# Altium project roneMotorBoard-v14.PrjPcb
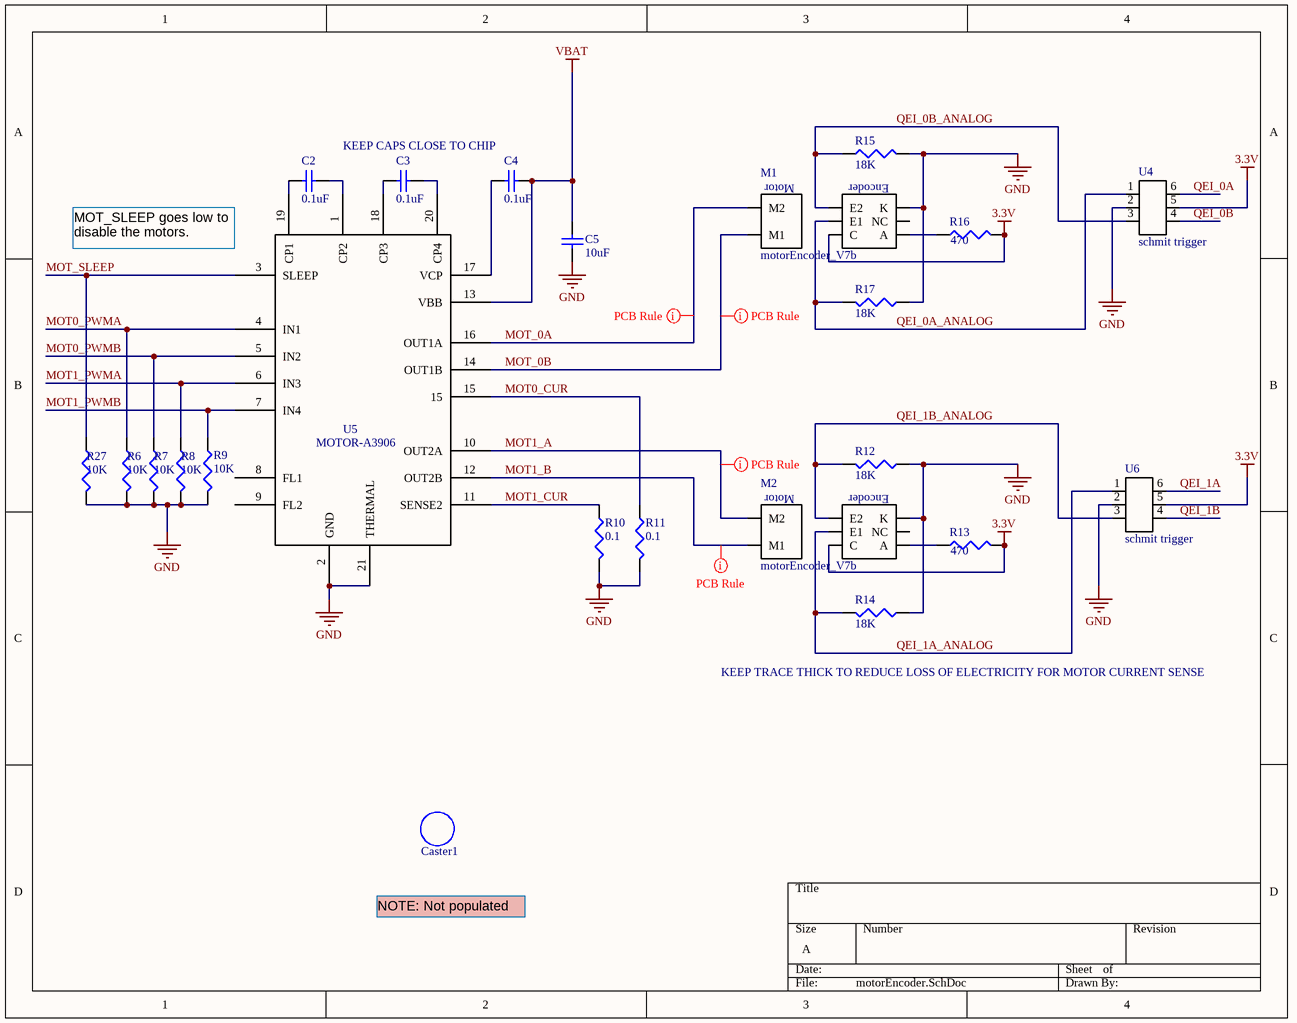
[diagram p0: motorEncoder.SchDoc]
3 sheets, 79 parts. Net scope: global (net labels, ports and power ports of the same name join across sheets).
Board file: roneMotorBoard-v14.PcbDoc
Sheets:
  motorEncoder.SchDoc
  Power.SchDoc
  BumpSensors.SchDoc

## Sheet motorEncoder.SchDoc: r-one Motor
size A; Date: 08/09/2011; DrawnBy: MRSL; Engineer: MRSL; Organization: Rice University; Revision: V11; SheetNumber: roneV11-motorEncoder; SheetTotal: 6; DocumentName: RoneV11-motorEncoder

### Parts
C2  value 0.1uF  [CAPC1005L]  (hidden comment: Cap Semi)
C3  value 0.1uF  [CAPC1005L]  (hidden comment: Cap Semi)
C4  value 0.1uF  [CAPC1005L]  (hidden comment: Cap Semi)
C5  value 10uF  [CAPC1608L]  (hidden comment: Cap Semi)
Caster1  non connect  [3/4"CASTER2]  (value not drawn)
M1  motorEncoder_V7b  [motorEncoder_V7b]
M2  motorEncoder_V7b  [motorEncoder_V7b]
R6  value 10K  [RESC1608L]  (hidden comment: Res3)
R7  value 10K  [RESC1608L]  (hidden comment: Res3)
R8  value 10K  [RESC1608L]  (hidden comment: Res3)
R9  value 10K  [RESC1608L]  (hidden comment: Res3)
R10  value 0.1  [RESC1608L]  (hidden comment: Res3)
R11  value 0.1  [RESC1608L]  (hidden comment: Res3)
R12  value 18K  [RESC1608L]
R13  value 470  [RESC1608L]
R14  value 18K  [RESC1608L]
R15  value 18K  [RESC1608L]
R16  value 470  [RESC1608L]
R17  value 18K  [RESC1608L]
R27  value 10K  [CAPC1608L]  (hidden comment: Res3)
U4  schmit trigger  [DCK(R-PDSO-C6)]
U5  MOTOR-A3906  [QFN-20]
U6  schmit trigger  [DCK(R-PDSO-C6)]

### Nets
3.3V: M1.C M2.C R13.2 R16.2 U4.5 U6.5
GND: C5.1 M1.K M2.K R6.2 R7.2 R8.2 R9.2 R10.2 R11.2 R12.1 R14.1 R15.2 R17.1 R27.2 U4.2 U5.2(GND) U5.21(THERMAL) U6.2
VBAT: C4.1 C5.2 U5.13(VBB)
MOT0_CUR: R11.1 U5.15
MOT0_PWMA: R6.1 U5.4(IN1)
MOT0_PWMB: R7.1 U5.5(IN2)
MOT1_A: M2.M2 U5.10(OUT2A)
MOT1_B: M2.M1 U5.12(OUT2B)
MOT1_CUR: R10.1 U5.11(SENSE2)
MOT1_PWMA: R8.1 U5.6(IN3)
MOT1_PWMB: R9.1 U5.7(IN4)
MOT_0A: M1.M2 U5.16(OUT1A)
MOT_0B: M1.M1 U5.14(OUT1B)
MOT_SLEEP: R27.1 U5.3(SLEEP)
QEI_0A: U4.6
QEI_0A_ANALOG: M1.E1 R17.2 U4.1
QEI_0B: U4.4
QEI_0B_ANALOG: M1.E2 R15.1 U4.3
QEI_1A: U6.6
QEI_1A_ANALOG: M2.E1 R14.2 U6.1
QEI_1B: U6.4
QEI_1B_ANALOG: M2.E2 R12.2 U6.3
NetC2_1: C2.1 U5.19(CP1)
NetC2_2: C2.2 U5.1(CP2)
NetC3_1: C3.1 U5.18(CP3)
NetC3_2: C3.2 U5.20(CP4)
NetC4_2: C4.2 U5.17(VCP)
NetM1_A: M1.A R16.1
NetM2_A: M2.A R13.1

Not connected (* = marked no-connect by the designer): M1 NC; M2 NC; U5 8(FL1) 9(FL2)

### Layout directives
rule Width Constraint [Pref Width = 20mil    Min Width = 10mil    Max Width = 25mil]: MOT1_A, MOT1_B, MOT_0A, MOT_0B

### Notes on the sheet
- KEEP CAPS CLOSE TO CHIP
- (near U5) MOT_SLEEP goes low to disable the motors.
- KEEP TRACE THICK TO REDUCE LOSS OF ELECTRICITY FOR MOTOR CURRENT SENSE
- NOTE: Not populated
- (in symbol motorEncoder_V7b) Motor; Encoder

### Library data of the parts
C2-C5 = Cap Semi: Capacitor (Semiconductor SIM Model); Published: 8-Jun-2000; LatestRevisionDate: 29-May-2009; LatestRevisionNote: IPC-7351 Footprint Added.; PackageReference: C1206; Publisher: Altium Limited; PackageDescription: Chip Capacitor
Caster1 = Caster 3/4in: This is just a space saver to get the caster onto the pcb
R6-R17 R27 = Res3: Resistor; Published: 8-Jun-2000; LatestRevisionDate: 29-May-2009; LatestRevisionNote: IPC-7351 Footprint Added.; PackageReference: J1-0603; Publisher: Altium Limited; PackageDescription: Chip Resistor

## Sheet Power.SchDoc
size A; SheetNumber: roneV11-Power; SheetTotal: 6
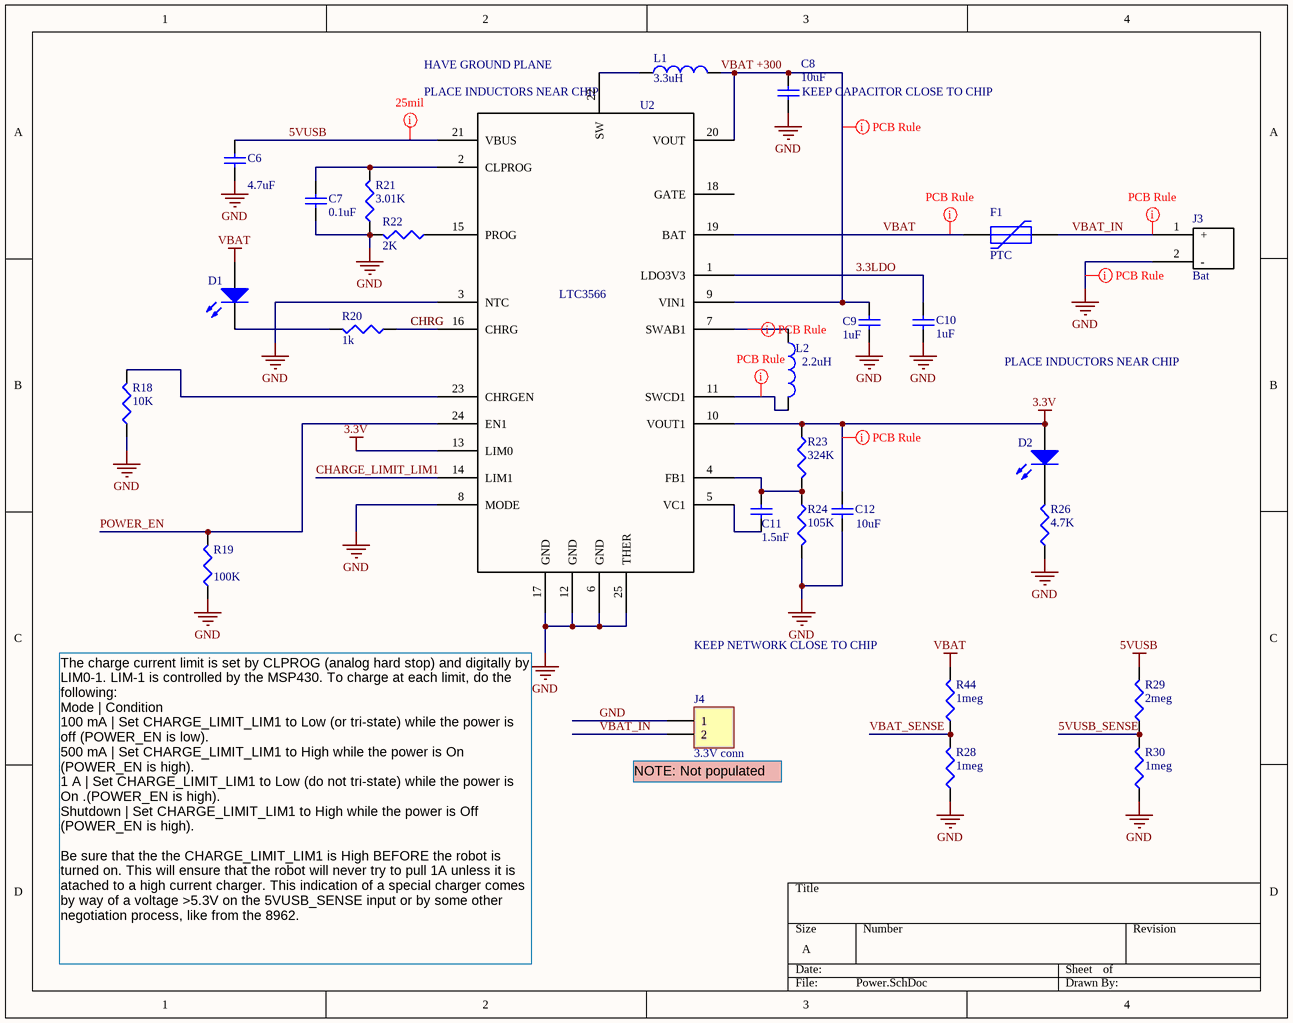
[diagram p1: Power.SchDoc]

### Parts
C6  value 4.7uF  [CAPC1608L]  (hidden comment: Cap Semi)
C7  value 0.1uF  [CAPC1005L]  (hidden comment: Cap)
C8  value 10uF  [CAPC1608L]  (hidden comment: Cap)
C9  value 1uF  [CAPC1608L]  (hidden comment: Cap)
C10  value 1uF  [CAPC1608L]  (hidden comment: Cap)
C11  value 1.5nF  [CAPC1005L]  (hidden comment: Cap)
C12  value 10uF  [CAPC1608L]  (hidden comment: Cap)
D1  Charge  [INDC2012L]  (value not drawn)
D2  Power  [INDC2012L]  (value not drawn)
F1  PTC  [ERJ8G-1206]
J3  Bat  [BatteryConnJST]
J4  3.3V conn  [HDR1X2]
L1  3.3uH  [IndPow]
L2  2.2uH  [IndPow]
R18  value 10K  [RESC1608L]  (hidden comment: Res3)
R19  value 100K  [RESC1608L]  (hidden comment: Res3)
R20  value 1k  [RESC1608L]  (hidden comment: Res3)
R21  value 3.01K  [RESC1608L]  (hidden comment: Res3)
R22  value 2K  [RESC1608L]  (hidden comment: Res3)
R23  value 324K  [RESC1608L]  (hidden comment: Res3)
R24  value 105K  [RESC1608L]  (hidden comment: Res3)
R26  value 4.7K  [RESC1608L]  (hidden comment: Res3)
R28  value 1meg  [RESC1608L]  (hidden comment: Res3)
R29  value 2meg  [RESC1608L]  (hidden comment: Res3)
R30  value 1meg  [RESC1608L]  (hidden comment: Res3)
R44  value 1meg  [RESC1608L]  (hidden comment: Res3)
U2  LTC3566  [QFN-24]

### Nets
3.3LDO: C10.1 U2.1(LDO3V3)
3.3V: C12.2 D2.1(A) R23.1 U2.10(VOUT1) U2.13(LIM0)
5VUSB: C6.2 R29.2 U2.21(VBUS)
GND: C6.1 C7.1 C8.1 C9.2 C10.2 C12.1 J3.2(-) J4.1 R18.1 R19.1 R21.1 R22.2 R24.2 R26.1 R28.1 R30.1 U2.3(NTC) U2.6(GND) U2.8(MODE) U2.12(GND) U2.17(GND) U2.25(THER)
VBAT: D1.1(A) F1.1 R44.2 U2.19(BAT)
5VUSB_SENSE: R29.1 R30.2
CHARGE_LIMIT_LIM1: U2.14(LIM1)
CHRG: R20.1 U2.16(CHRG)
POWER_EN: R19.2 U2.24(EN1)
VBAT +300: C8.2 C9.1 L1.2 U2.9(VIN1) U2.20(VOUT)
VBAT_IN: F1.2 J3.1(+) J4.2
VBAT_SENSE: R28.2 R44.1
NetC7_2: C7.2 R21.2 U2.2(CLPROG)
NetC11_1: C11.1 R23.2 R24.1 U2.4(FB1)
NetC11_2: C11.2 U2.5(VC1)
NetD1_2: D1.2(K) R20.2
NetD2_2: D2.2(K) R26.2
NetL1_1: L1.1 U2.22(SW)
NetL2_1: L2.1 U2.7(SWAB1)
NetL2_2: L2.2 U2.11(SWCD1)
NetR18_2: R18.2 U2.23(CHRGEN)
NetR22_1: R22.1 U2.15(PROG)

Not connected (* = marked no-connect by the designer): U2 18(GATE)

### Layout directives
rule Width Constraint [Pref Width = 25mil    Min Width = 10mil    Max Width = 25mil]: 5VUSB, GND, NetL2_1, NetL2_2, VBAT +300, VBAT_IN
rule Width Constraint [Pref Width = 25mil    Min Width = 10mil    Max Width = 100mil]: 3.3V
rule Width Constraint [Pref Width = 25mil    Min Width = 10mil    Max Width = 50mil]: VBAT

### Notes on the sheet
- (near U2) HAVE GROUND PLANE
- (near U2) PLACE INDUCTORS NEAR CHIP
- (near C8) KEEP CAPACITOR CLOSE TO CHIP
- CHRG
- PLACE INDUCTORS NEAR CHIP
- KEEP NETWORK CLOSE TO CHIP
- (near J4) NOTE: Not populated
- The charge current limit is set by CLPROG (analog hard stop) and digitally by LIM0-1. LIM-1 is controlled by the MSP430. To charge at each limit, do the following:
  Mode	| Condition
  100 mA	| Set CHARGE_LIMIT_LIM1 to Low (or tri-state) while the power is off (POWER_EN is low).
  500 mA	| Set CHARGE_LIMIT_LIM1 to High while the power is On (POWER_EN is high).
  1 A	| Set CHARGE_LIMIT_LIM1 to Low (do not tri-state) while the power is On .(POWER_EN is high).
  Shutdown | Set CHARGE_LIMIT_LIM1 to High while the power is Off (POWER_EN is high).
  Be sure that the the CHARGE_LIMIT_LIM1 is High BEFORE the robot is turned on. This will ensure that the robot will never try to pull 1A unless it is atached to a high current charger. This indication of a special charger comes by way of a voltage >5.3V on the 5VUSB_SENSE input or by some other negotiation process, like from the 8962.

### Library data of the parts
C6 = Cap Semi: Capacitor (Semiconductor SIM Model); Published: 8-Jun-2000; LatestRevisionDate: 29-May-2009; LatestRevisionNote: IPC-7351 Footprint Added.; PackageReference: C1206; Publisher: Altium Limited; PackageDescription: Chip Capacitor
C7-C12 = Cap: Capacitor; Published: 8-Jun-2000; LatestRevisionDate: 17-Jul-2002; LatestRevisionNote: Re-released for DXP Platform.; PackageReference: RAD-0.3; Publisher: Altium Limited
D1 D2 = LED2: Typical RED, GREEN, YELLOW, AMBER GaAs LED; Published: 8-Jun-2000; LatestRevisionDate: 17-Jul-2002; LatestRevisionNote: Re-released for DXP Platform.; PackageVersion: Feb-2002; PackageReference: 3.2X1.6X1.1; Publisher: Altium Limited
F1 = PTC_FUSE: Fuse; Published: 8-Jun-2000; LatestRevisionDate: 17-Jul-2002; LatestRevisionNote: Re-released for DXP Platform.; PackageReference: PIN-W2/E2.8; Publisher: Altium Limited
J3 = BatteryConnJST
J4 = Header 2: Header, 2-Pin; LatestRevisionDate: 17-Jul-2002; LatestRevisionNote: Re-released for DXP Platform.; Publisher: Altium Limited
L1 L2 = Inductor
  L1: Value: 3.3uH
  L2: Value: 2.2uH
R18-R24 R26 R28-R30 R44 = Res3: Resistor; Published: 8-Jun-2000; LatestRevisionDate: 29-May-2009; LatestRevisionNote: IPC-7351 Footprint Added.; PackageReference: J1-0603; Publisher: Altium Limited; PackageDescription: Chip Resistor

## Sheet BumpSensors.SchDoc
size A; SheetNumber: roneV11-BumpSensors; SheetTotal: 6
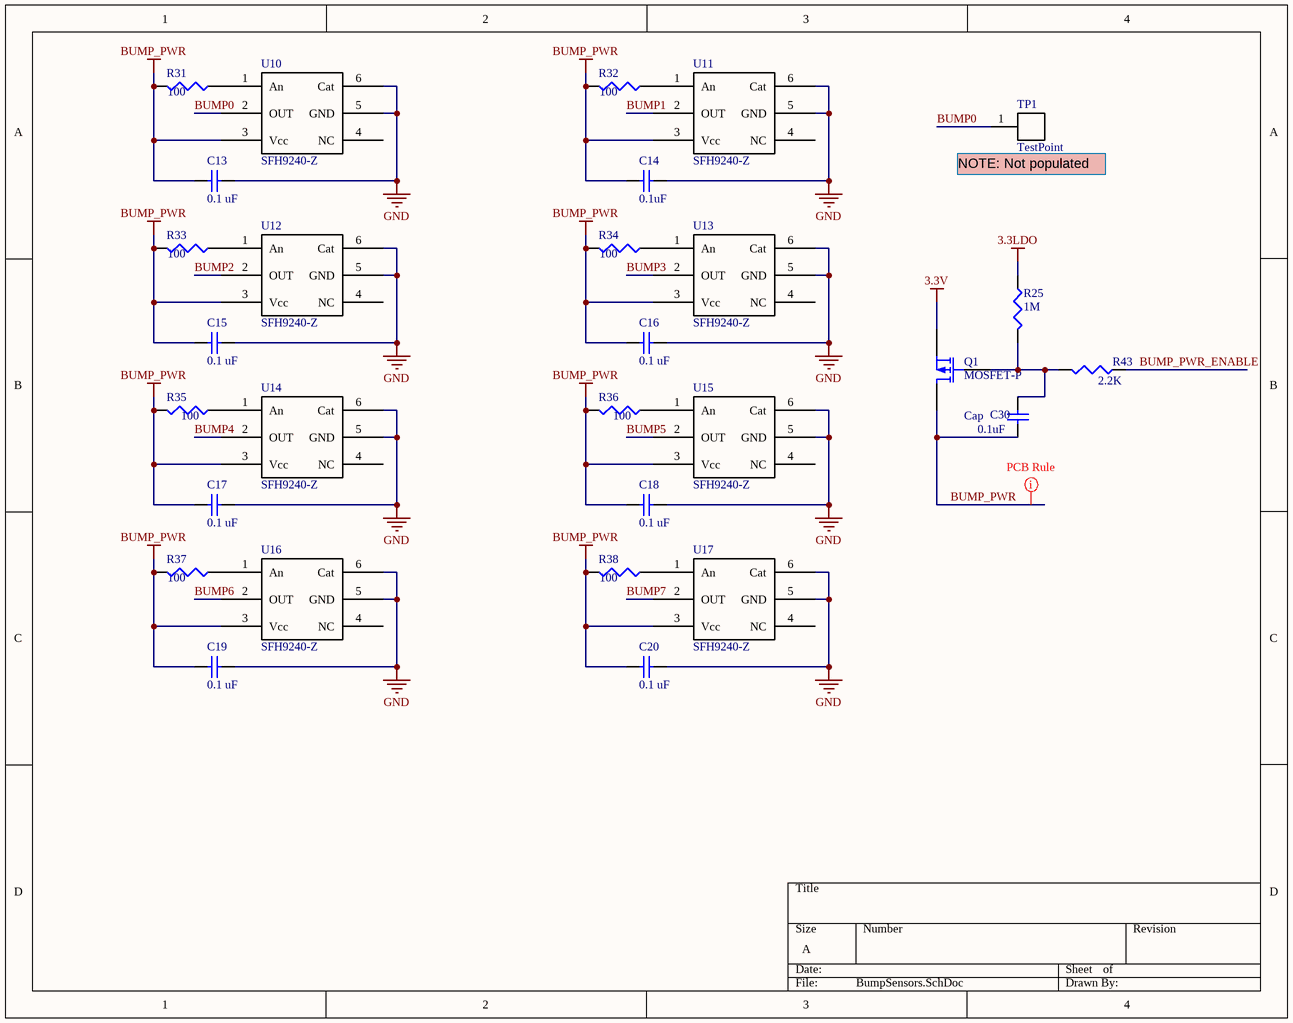
[diagram p2: BumpSensors.SchDoc]

### Parts
C13  value 0.1 uF  [CAPC1005L]  (hidden comment: Cap Semi)
C14  value 0.1uF  [CAPC1005L]  (hidden comment: Cap Semi)
C15  value 0.1 uF  [CAPC1005L]  (hidden comment: Cap Semi)
C16  value 0.1 uF  [CAPC1005L]  (hidden comment: Cap Semi)
C17  value 0.1 uF  [CAPC1005L]  (hidden comment: Cap Semi)
C18  value 0.1 uF  [CAPC1005L]  (hidden comment: Cap Semi)
C19  value 0.1 uF  [CAPC1005L]  (hidden comment: Cap Semi)
C20  value 0.1 uF  [CAPC1005L]  (hidden comment: Cap Semi)
C30  Cap  value 0.1uF  [CAPC1005L]
Q1  MOSFET-P  [SOT-23]
R25  value 1M  [J1-0603]  (hidden comment: Res3)
R31  value 100  [RESC1608L]  (hidden comment: Res3)
R32  value 100  [RESC1608L]  (hidden comment: Res3)
R33  value 100  [RESC1608L]  (hidden comment: Res3)
R34  value 100  [RESC1608L]  (hidden comment: Res3)
R35  value 100  [RESC1608L]  (hidden comment: Res3)
R36  value 100  [RESC1608L]  (hidden comment: Res3)
R37  value 100  [RESC1608L]  (hidden comment: Res3)
R38  value 100  [RESC1608L]  (hidden comment: Res3)
R43  value 2.2K  [J1-0603]  (hidden comment: Res3)
TP1  TestPoint  [TestPoint]
U10  SFH9240-Z  [SFH9240-Z]
U11  SFH9240-Z  [SFH9240-Z]
U12  SFH9240-Z  [SFH9240-Z]
U13  SFH9240-Z  [SFH9240-Z]
U14  SFH9240-Z  [SFH9240-Z]
U15  SFH9240-Z  [SFH9240-Z]
U16  SFH9240-Z  [SFH9240-Z]
U17  SFH9240-Z  [SFH9240-Z]

### Nets
3.3LDO: R25.1
3.3V: Q1.2(S)
BUMP_PWR: C13.2 C14.2 C15.2 C16.2 C17.2 C18.2 C19.2 C20.2 C30.2 Q1.3(D) R31.2 R32.2 R33.2 R34.2 R35.2 R36.2 R37.2 R38.2 U10.3(Vcc) U11.3(Vcc) U12.3(Vcc) U13.3(Vcc) U14.3(Vcc) U15.3(Vcc) U16.3(Vcc) U17.3(Vcc)
GND: C13.1 C14.1 C15.1 C16.1 C17.1 C18.1 C19.1 C20.1 U10.5(GND) U10.6(Cat) U11.5(GND) U11.6(Cat) U12.5(GND) U12.6(Cat) U13.5(GND) U13.6(Cat) U14.5(GND) U14.6(Cat) U15.5(GND) U15.6(Cat) U16.5(GND) U16.6(Cat) U17.5(GND) U17.6(Cat)
BUMP0: TP1.1 U10.2(OUT)
BUMP1: U11.2(OUT)
BUMP2: U12.2(OUT)
BUMP3: U13.2(OUT)
BUMP4: U14.2(OUT)
BUMP5: U15.2(OUT)
BUMP6: U16.2(OUT)
BUMP7: U17.2(OUT)
BUMP_PWR_ENABLE: R43.1
NetC30_1: C30.1 Q1.1(G) R25.2 R43.2
NetR31_1: R31.1 U10.1(An)
NetR32_1: R32.1 U11.1(An)
NetR33_1: R33.1 U12.1(An)
NetR34_1: R34.1 U13.1(An)
NetR35_1: R35.1 U14.1(An)
NetR36_1: R36.1 U15.1(An)
NetR37_1: R37.1 U16.1(An)
NetR38_1: R38.1 U17.1(An)

Not connected (* = marked no-connect by the designer): U10 4(NC); U11 4(NC); U12 4(NC); U13 4(NC); U14 4(NC); U15 4(NC); U16 4(NC); U17 4(NC)

### Layout directives
rule Width Constraint [Pref Width = 15mil    Min Width = 10mil    Max Width = 15mil]: BUMP_PWR

### Notes on the sheet
- (near TP1) NOTE: Not populated

### Library data of the parts
C13-C20 = Cap Semi: Capacitor (Semiconductor SIM Model); Published: 8-Jun-2000; LatestRevisionDate: 29-May-2009; LatestRevisionNote: IPC-7351 Footprint Added.; PackageReference: C1206; Publisher: Altium Limited; PackageDescription: Chip Capacitor
C30 = Cap: Capacitor; Published: 8-Jun-2000; LatestRevisionDate: 17-Jul-2002; LatestRevisionNote: Re-released for DXP Platform.; PackageReference: RAD-0.3; Publisher: Altium Limited
Q1 = MOSFET-P: P-Channel MOSFET; Published: 8-Jun-2000; LatestRevisionDate: 17-Jul-2002; LatestRevisionNote: Re-released for DXP Platform.; PackageVersion: 1995/1996; PackageReference: E3; Publisher: Altium Limited
R25 R31-R38 R43 = Res3: Resistor; Published: 8-Jun-2000; LatestRevisionDate: 29-May-2009; LatestRevisionNote: IPC-7351 Footprint Added.; PackageReference: J1-0603; Publisher: Altium Limited; PackageDescription: Chip Resistor

## Nets that join several sheets
3.3LDO: Power (C10.1 U2.1), BumpSensors (R25.1)
3.3V: motorEncoder (6 pins), Power (5 pins), BumpSensors (Q1.2)
GND: motorEncoder (18 pins), Power (22 pins), BumpSensors (24 pins)
VBAT: motorEncoder (C4.1 C5.2 U5.13), Power (D1.1 F1.1 R44.2 U2.19)